# Altium schematic sheet ESIMA NFC-Verbindungsleitung.SchDoc: Esima E-Meter NFC-Leitung
size A3; DrawnBy: Jürgen Merz; Address1: Wilhelm- Schickard- Strasse 10; Address2: 78052 Villingen Schwenningen; Address3: juergen.merz@hsg-imit.de; Address4: Tel. +49 7721 943 138; PhoneNumber: +49 7721 943 138; FaxNumber: +49 7721 943 140
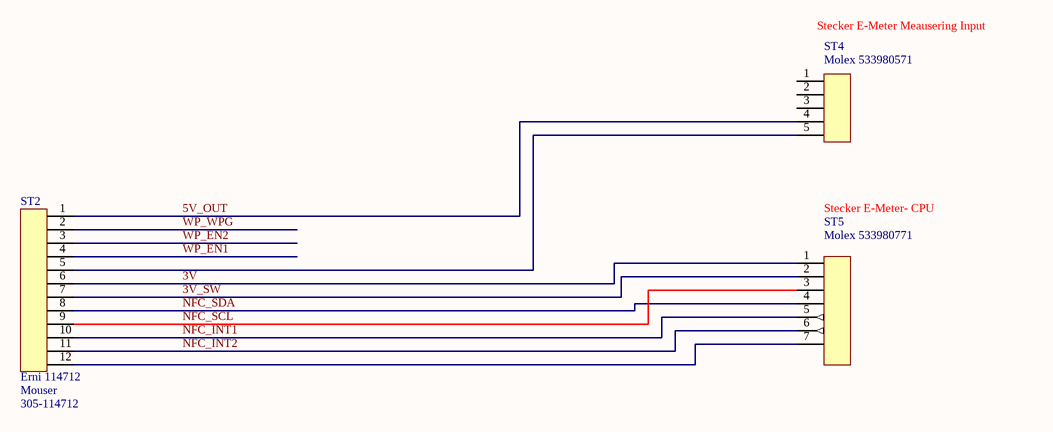
[diagram p0: ESIMA NFC-Verbindungsleitung.SchDoc]

## Parts
ST2  Erni 114712  Supplier 1: Mouser  Supplier Part Number 1: 305-114712  [Erni 114712]
ST4  Molex 533980571  [Molex 533980571]
ST5  Molex 533980771  [Molex 533980771]

## Nets
3V: ST2.6 ST5.1
3V_SW: ST2.7 ST5.2
5V_OUT: ST2.1 ST4.4
NFC_INT1: ST2.10 ST5.5
NFC_INT2: ST2.11 ST5.6
NFC_SCL: ST2.9 ST5.3
NFC_SDA: ST2.8 ST5.4
WP_EN1: ST2.4
WP_EN2: ST2.3
WP_~{WPG}: ST2.2
NetST2_5: ST2.5 ST4.5
NetST2_12: ST2.12 ST5.7

Not connected (* = marked no-connect by the designer): ST2 13 14; ST4 1 2 3 6 7; ST5 8 9

## Notes on the sheet
- (near ST4) Stecker E-Meter Meausering Input
- Stecker E-Meter- CPU
- Title
- Size:
- Date:
- A3
- Number:
- Time:
- Revision:
- Sheet
- of
- File:

## Library data of the parts
ST2 = Erni 114712: Erni MicroStac 12pol, 0.8mm Raster
ST4 = Molex 533980571: MOLEX - 53398-0571 - STIFTLEISTE, SMT, 1.25MM, 5POL; Supplier 1: Farnell; Supplier Part Number 1: 2426364
ST5 = Molex 533980771: Molex Pico 7Pol Blade SMD gerade 533980771; Supplier 1: Farnell; Supplier Part Number 1: 9786368